# EAGLE design Keypad (EAGLE 8.5.1)
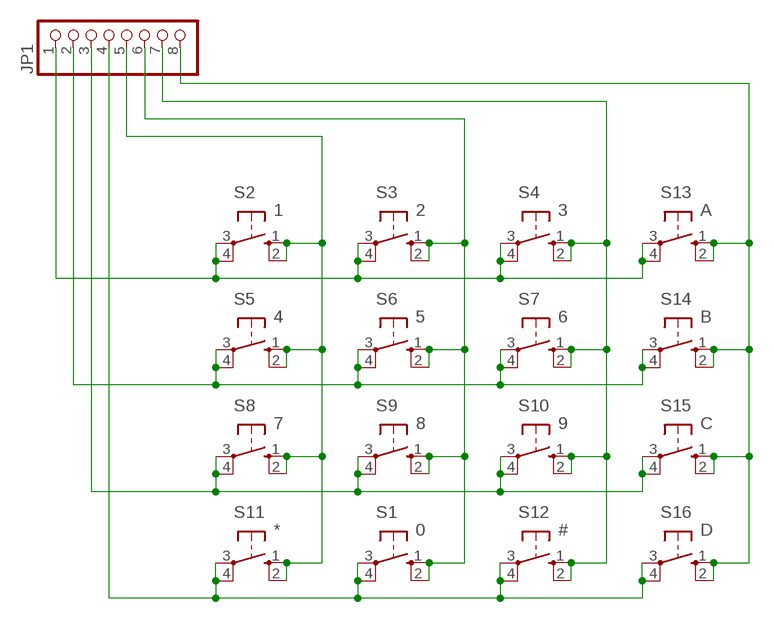
[diagram p0: schematic, sheet 1]

## Parts
JP1  PINHD-1X8  [1X08]
S1  0  10-XX  [B3F-10XX]
S2  1  10-XX  [B3F-10XX]
S3  2  10-XX  [B3F-10XX]
S4  3  10-XX  [B3F-10XX]
S5  4  10-XX  [B3F-10XX]
S6  5  10-XX  [B3F-10XX]
S7  6  10-XX  [B3F-10XX]
S8  7  10-XX  [B3F-10XX]
S9  8  10-XX  [B3F-10XX]
S10  9  10-XX  [B3F-10XX]
S11  *  10-XX  [B3F-10XX]
S12  #  10-XX  [B3F-10XX]
S13  A  10-XX  [B3F-10XX]
S14  B  10-XX  [B3F-10XX]
S15  C  10-XX  [B3F-10XX]
S16  D  10-XX  [B3F-10XX]

## Nets
C1: JP1.5 S2.1(S) S2.2(S1) S5.1(S) S5.2(S1) S8.1(S) S8.2(S1) S11.1(S) S11.2(S1)
C2: JP1.6 S1.1(S) S1.2(S1) S3.1(S) S3.2(S1) S6.1(S) S6.2(S1) S9.1(S) S9.2(S1)
C3: JP1.7 S4.1(S) S4.2(S1) S7.1(S) S7.2(S1) S10.1(S) S10.2(S1) S12.1(S) S12.2(S1)
C4: JP1.8 S13.1(S) S13.2(S1) S14.1(S) S14.2(S1) S15.1(S) S15.2(S1) S16.1(S) S16.2(S1)
R1: JP1.1 S2.3(P) S2.4(P1) S3.3(P) S3.4(P1) S4.3(P) S4.4(P1) S13.3(P) S13.4(P1)
R2: JP1.2 S5.3(P) S5.4(P1) S6.3(P) S6.4(P1) S7.3(P) S7.4(P1) S14.3(P) S14.4(P1)
R3: JP1.3 S8.3(P) S8.4(P1) S9.3(P) S9.4(P1) S10.3(P) S10.4(P1) S15.3(P) S15.4(P1)
R4: JP1.4 S1.3(P) S1.4(P1) S11.3(P) S11.4(P1) S12.3(P) S12.4(P1) S16.3(P) S16.4(P1)

## Library data of the parts
JP1 = pinhead:PINHD-1X8: PIN HEADER
S1-S16 = switch-omron:10-XX: OMRON SWITCH; MPN: B3F-1000; OC_FARNELL: 176432; OC_NEWARK: 36M3542

## Board
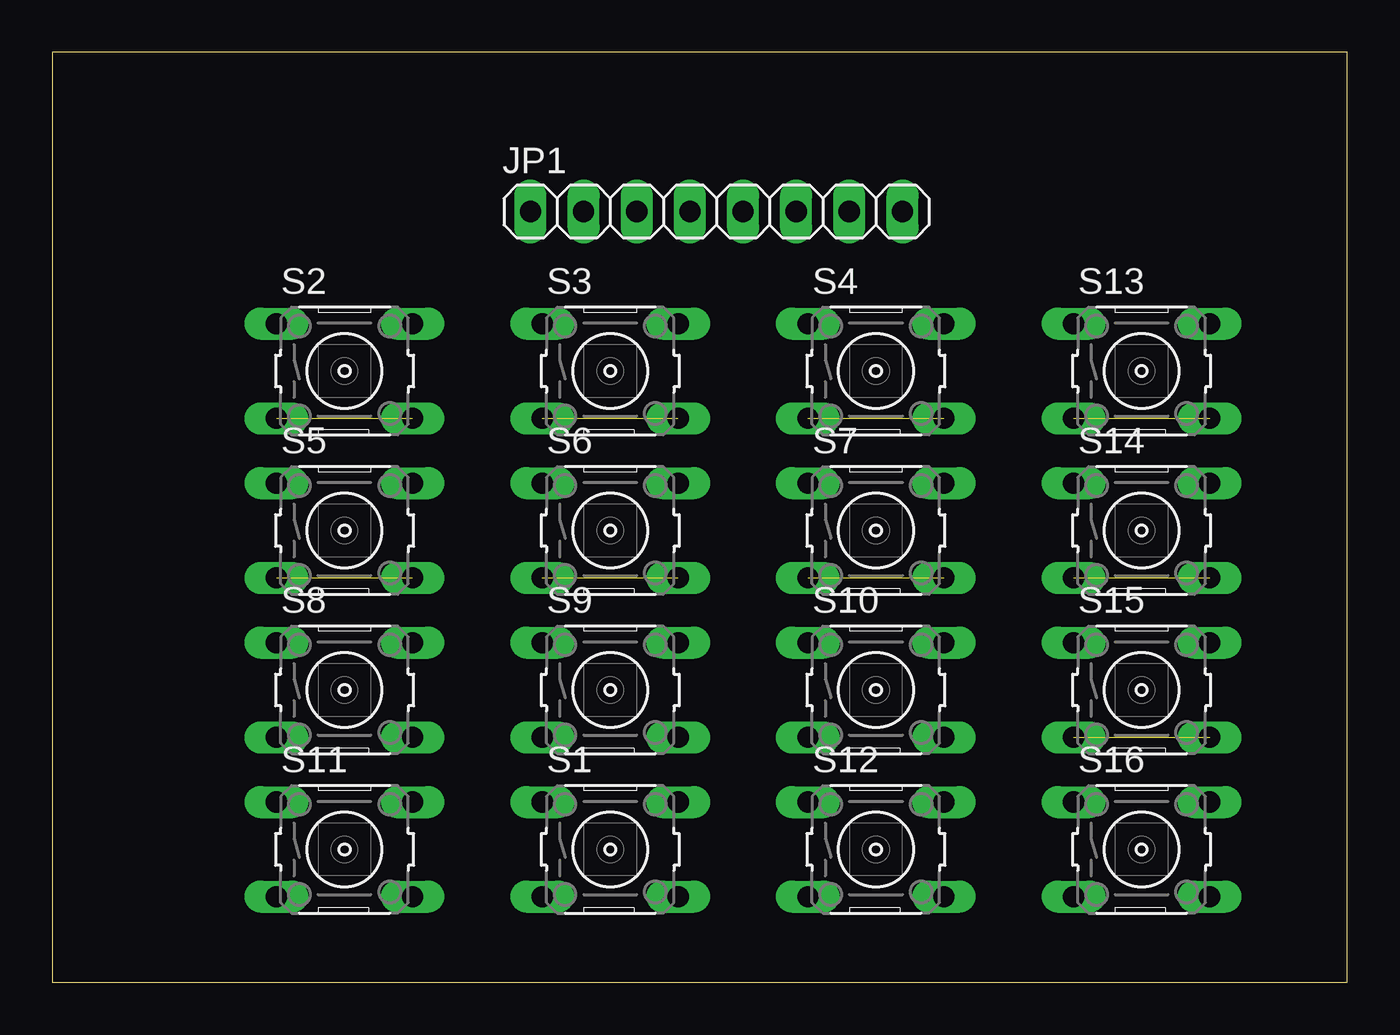
[diagram p1: board, top side]
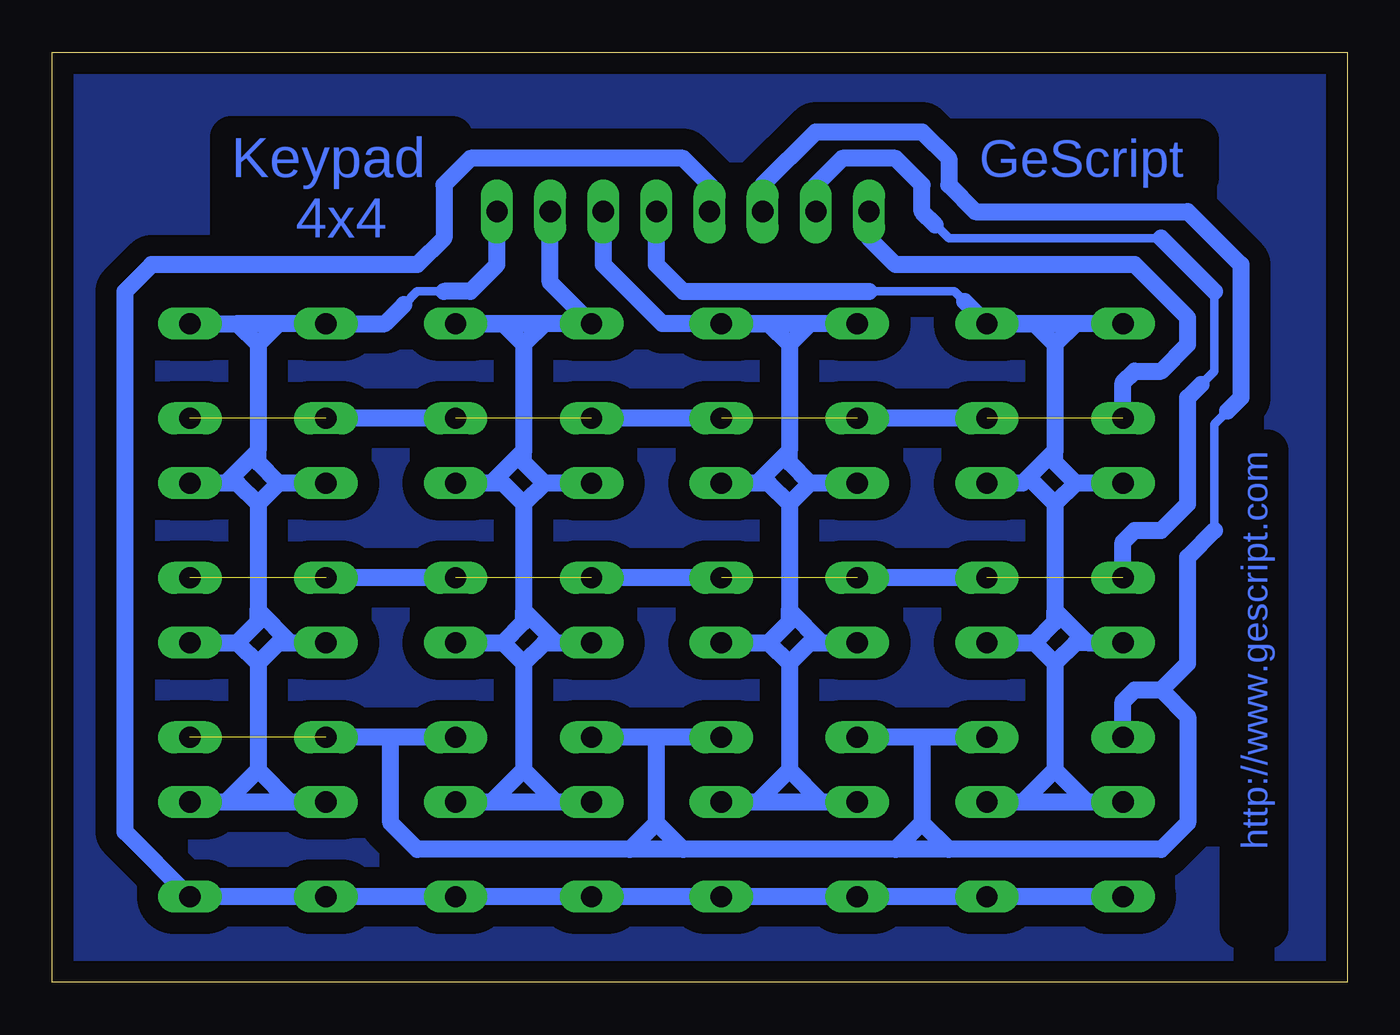
[diagram p2: board, bottom side, seen from below]

Size 61.9 x 44.44 mm. Coordinates in mm from the lower left corner, seen from the top.
Outline: 0,0 61.9,0 61.9,44.44 0,44.44 0,0
Copper layers (1*16): Top 0.035mm / dielectric 1.5mm / Bottom 0.035mm
Design rules "default": minimum track width 6mil, minimum drill 0.35mm, track to track 6mil, track to pad 6mil, pad to pad 6mil, via to via 6mil, smd to smd 6mil, copper to edge 40mil, drill to drill 6mil, minimum pad ring 10mil, minimum via ring 8mil, stop-mask expansion 4mil, vias tented up to drill 0mil, thermal gap 10mil

### Footprints (pad centres in the part's own frame; a part is rotated, then mirrored left to right if it is on the bottom)
1X08 = drill 1.016 long: 1 -8.89,0; 2 -6.35,0; 3 -3.81,0; 4 -1.27,0; 5 1.27,0; 6 3.81,0; 7 6.35,0; 8 8.89,0
B3F-10XX = drill 1.016 long: 1 -3.251,2.261; 2 3.251,2.261; 3 -3.251,-2.261; 4 3.251,-2.261

### Placement (x,y rotation side)
JP1  31.75,36.83 0 top
S1  26.67,6.35 0 top
S2  13.97,29.21 0 top
S3  26.67,29.21 0 top
S4  39.37,29.21 0 top
S5  13.97,21.59 0 top
S6  26.67,21.59 0 top
S7  39.37,21.59 0 top
S8  13.97,13.97 0 top
S9  26.67,13.97 0 top
S10  39.37,13.97 0 top
S11  13.97,6.35 0 top
S12  39.37,6.35 0 top
S13  52.07,29.21 0 top
S14  52.07,21.59 0 top
S15  52.07,13.97 0 top
S16  52.07,6.35 0 top

### Tracks (layer width: path | path; a pad name or v marks a point on that pad's centre or on a via)
C1
  Bottom 0.406: 22.86,33.02 18.77,33.02 18.28,32.53
  Bottom 0.813: S2.2 14.96,31.47 13.97,30.48 | 13.97,30.48 13.97,25.4 | S5.2 15.52,23.85 15.24,24.13 | 13.97,25.4 15.24,24.13 | S5.1 12.98,23.85 | 12.98,23.85 13.97,22.86 | 13.97,22.86 13.97,17.78 | 13.97,17.78 12.42,16.23 | 12.42,16.23 S8.1 | S8.2 14.96,16.23 | 14.96,16.23 13.97,15.24 | 13.97,15.24 13.97,10.16 | 13.97,10.16 15.52,8.61 S11.2 S11.1 12.42,8.61 13.97,10.16 | 18.28,32.53 S2.2 | 22.86,33.02 31.75,33.02 33.02,34.29 JP1.5 | 13.97,30.48 12.98,31.47 S2.1 S2.2 | 12.98,23.85 13.97,24.84 13.97,25.4 | 14.96,16.23 13.97,17.22 13.97,17.78 | 13.97,22.86 15.24,24.13 | 12.42,16.23 12.98,16.23 13.97,15.24
C2
  Bottom 0.813: S3.2 27.66,31.47 26.67,30.48 | 26.67,30.48 26.67,25.4 | 28.22,23.85 S6.2 | 26.67,25.4 28.22,23.85 | S6.1 25.68,23.85 | 25.68,23.85 26.67,22.86 | 26.67,22.86 26.67,17.78 | 25.12,16.23 S9.1 | 26.67,17.78 25.12,16.23 | S9.2 27.66,16.23 | 27.66,16.23 26.67,15.24 | 26.67,15.24 26.67,10.16 | 26.67,10.16 28.22,8.61 S1.2 S1.1 25.12,8.61 26.67,10.16 | S3.2 32.74,31.47 35.56,34.29 JP1.6 | 26.67,30.48 25.68,31.47 S3.1 S3.2 | 25.68,23.85 26.67,24.84 26.67,25.4 | 27.66,16.23 26.67,17.22 26.67,17.78 | 26.67,22.86 27.66,23.85 28.22,23.85 | 26.67,15.24 25.68,16.23 25.12,16.23
C3
  Bottom 0.813: 39.37,30.48 40.36,31.47 S4.2 S4.1 | 39.37,30.48 39.37,25.4 | 40.92,23.85 S7.2 | 39.37,25.4 40.92,23.85 | S7.1 38.38,23.85 | 38.38,23.85 39.37,22.86 | 39.37,22.86 39.37,17.78 | 37.82,16.23 S10.1 | 39.37,17.78 37.82,16.23 | S10.2 40.36,16.23 | 40.36,16.23 39.37,15.24 | 39.37,15.24 39.37,10.16 | 39.37,10.16 40.92,8.61 S12.2 S12.1 37.82,8.61 39.37,10.16 | S4.1 38.1,33.45 JP1.7 | S4.1 38.38,31.47 39.37,30.48 | 38.38,23.85 39.37,24.84 39.37,25.4 | 40.36,16.23 39.37,17.22 39.37,17.78 | 39.37,15.24 38.38,16.23 37.82,16.23 | 39.37,22.86 40.36,23.85 40.92,23.85
C4
  Bottom 0.406: 43.18,33.02 44.45,33.02 45.09,32.39
  Bottom 0.813: S13.2 53.06,31.47 | 53.06,31.47 52.07,30.48 | 52.07,30.48 52.07,25.4 | 53.62,23.85 S14.2 | 52.07,25.4 53.62,23.85 | S14.1 51.08,23.85 | 51.08,23.85 52.07,22.86 | 52.07,22.86 52.07,17.78 | 50.52,16.23 S15.1 | 52.07,17.78 50.52,16.23 | S15.2 53.06,16.23 | 53.06,16.23 52.07,15.24 | 52.07,15.24 52.07,10.16 | 52.07,10.16 53.62,8.61 S16.2 S16.1 50.52,8.61 52.07,10.16 | JP1.8 40.64,34.29 41.91,33.02 43.18,33.02 | S13.1 46,31.47 45.09,32.39 | S13.1 51.08,31.47 52.07,30.48 | 51.08,23.85 52.07,24.84 52.07,25.4 | 53.06,16.23 52.07,17.22 52.07,17.78 | S13.1 53.06,31.47 | 52.07,22.86 53.06,23.85 53.62,23.85 | 52.07,15.24 51.08,16.23 50.52,16.23
N$1
  pour Bottom (isolate 1.016): 1.27,43.18 60.96,43.18 60.96,1.27 1.27,1.27
R1  (4 unrouted)
  Bottom 0.813: S2.4 S3.3 | S3.4 S4.3 | S4.4 S13.3 | S2.3 10.72,28.65 10.16,29.21 8.89,29.21 7.62,30.48 7.62,31.75 10.16,34.29 21.59,34.29 22.86,35.56 JP1.1
R2  (4 unrouted)
  Bottom 0.406: 6.35,33.02 6.35,29.21 6.99,28.57 | 8.89,35.56 19.05,35.56 19.69,36.19
  Bottom 0.813: S5.4 S6.3 | S6.4 S7.3 | S7.4 S14.3 | JP1.2 25.4,38.1 24.13,39.37 21.59,39.37 20.32,38.1 20.32,36.83 19.69,36.19 | 6.35,33.02 8.89,35.56 | 6.99,28.57 7.62,27.94 7.62,22.86 8.89,21.59 10.16,21.59 10.72,21.03 S5.3
R3  (1 unrouted)
  Bottom 0.406: 6.35,21.59 6.35,26.67 5.72,27.3
  Bottom 0.813: S8.4 20.32,11.71 | 20.32,11.71 S9.3 | S9.4 33.02,11.71 | 33.02,11.71 S10.3 | S10.4 45.72,11.71 | 45.72,11.71 S15.3 | JP1.3 27.94,38.1 25.4,40.64 20.32,40.64 19.05,39.37 19.05,38.1 17.78,36.83 7.62,36.83 5.08,34.29 5.08,27.94 5.72,27.3 | 6.35,21.59 7.62,20.32 7.62,15.24 8.89,13.97 | S8.3 10.72,13.41 10.16,13.97 8.89,13.97 | 20.32,11.71 20.32,7.62 | 20.32,7.62 21.59,6.35 31.75,6.35 33.02,7.62 | 33.02,7.62 33.02,11.71 | 33.02,7.62 34.29,6.35 | 34.29,6.35 44.45,6.35 45.72,7.62 45.72,11.71 | 8.89,13.97 7.62,12.7 7.62,7.62 8.89,6.35 19.05,6.35 | 19.05,6.35 20.32,7.62 | 19.05,6.35 34.29,6.35
R4
  Bottom 0.813: JP1.4 30.48,38.1 31.75,39.37 41.91,39.37 43.18,38.1 43.18,35.56 44.45,34.29 57.15,34.29 58.42,33.02 58.42,7.19 S16.4 S16.3 S12.4 S12.3 S1.4 S1.3 S11.4 S11.3

### Text on the board
Bottom: GeScript | Keypad / 4x4 | http://www.gescript.com